# Altium schematic sheet Radio.SchDoc
size Letter; SheetNumber: 10
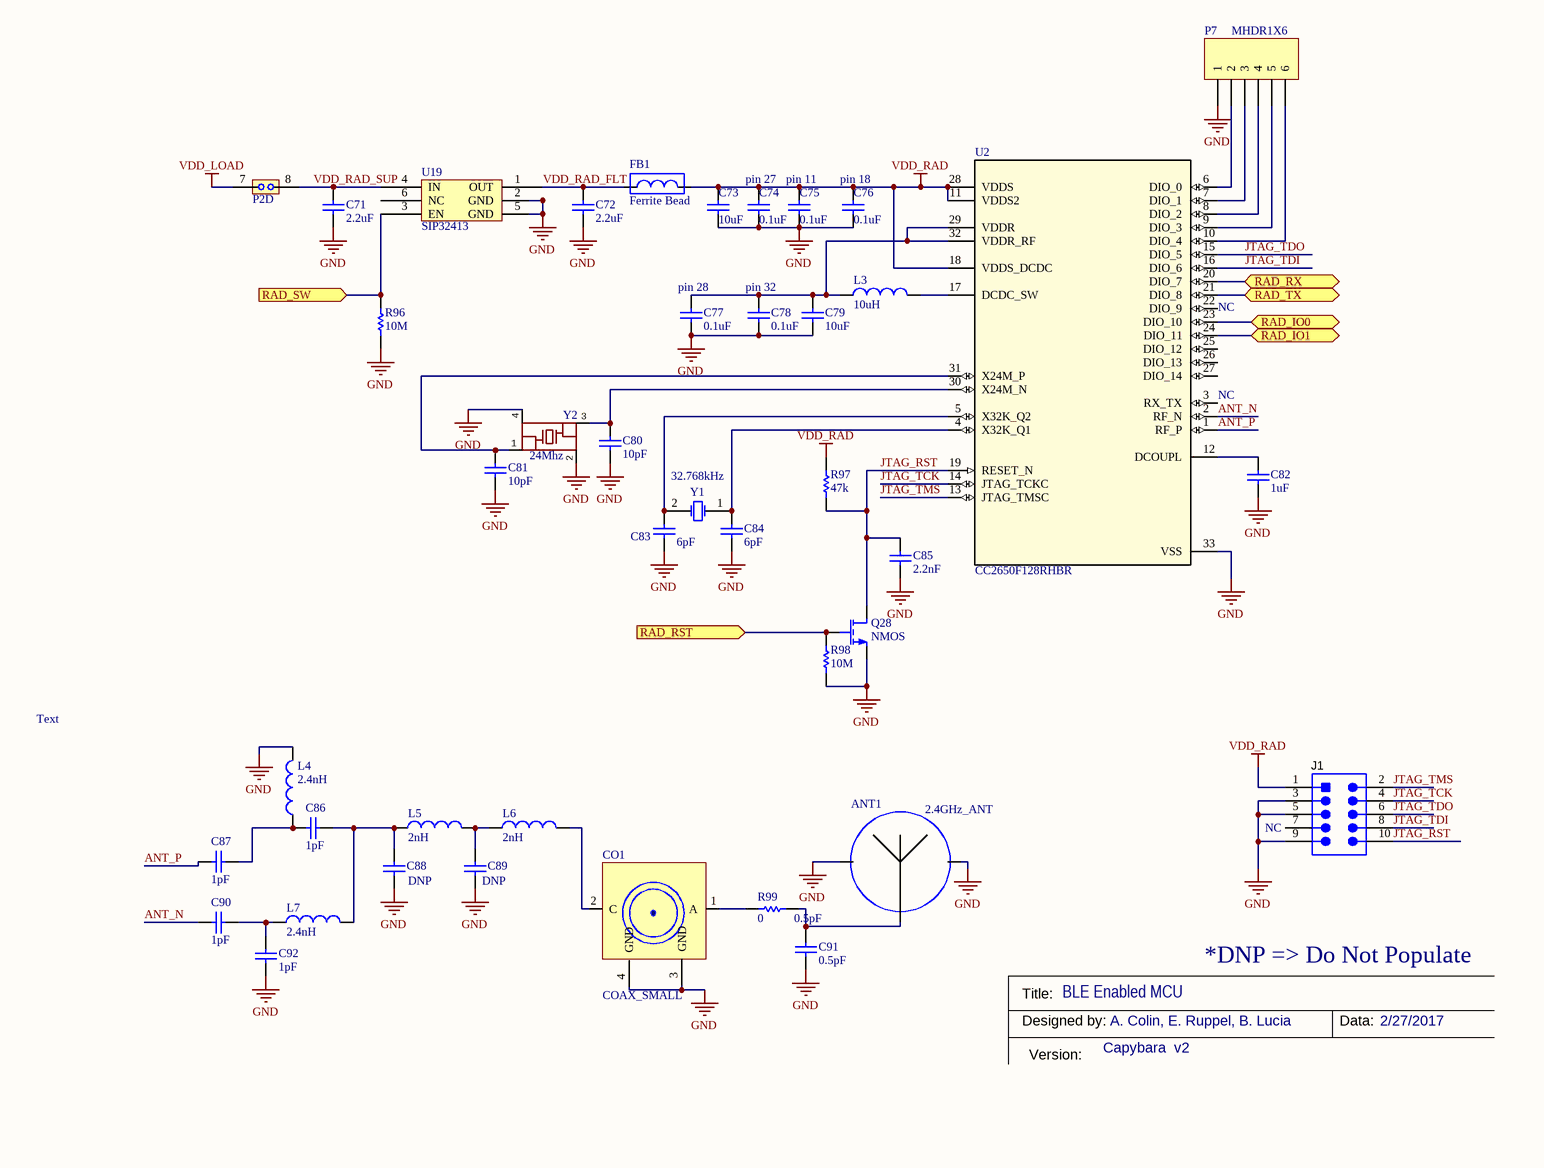
[diagram p0: Radio.SchDoc, bottom left]

## Parts
ANT1  2.4GHz_ANT  [IIF_INV]  (net tie, no BOM)
C71  value 2.2uF  [0603]  (hidden comment: Cap)
C72  value 2.2uF  [0603]  (hidden comment: Cap)
C73  value 10uF  [0603]  (hidden comment: Cap)
C74  value 0.1uF  [0603]  (hidden comment: Cap)
C75  value 0.1uF  [0603]  (hidden comment: Cap)
C76  value 0.1uF  [0603]  (hidden comment: Cap)
C77  value 0.1uF  [0603]  (hidden comment: Cap)
C78  value 0.1uF  [0603]  (hidden comment: Cap)
C79  value 10uF  [0603]  (hidden comment: Cap)
C80  value 10pF  [0402]  (hidden comment: Cap)
C81  value 10pF  [0402]  (hidden comment: Cap)
C82  value 1uF  [0603]  (hidden comment: Cap)
C83  value 6pF  [0402]  (hidden comment: Cap)
C84  value 6pF  [0402]  (hidden comment: Cap)
C85  value 2.2nF  [0603]  (hidden comment: Cap)
C86  value 1pF  [0402]  (hidden comment: Cap)
C87  value 1pF  [0402]  (hidden comment: Cap)
C88  Note: DNP  [0402]  (hidden comment: Cap)
C89  Note: DNP  [0402]  (hidden comment: Cap)
C90  value 1pF  [0402]  (hidden comment: Cap)
C91  value 0.5pF  Note: 0.5pF  [0402]  (hidden comment: Cap)
C92  value 1pF  [0402]  (hidden comment: Cap)
CO1  COAX_SMALL  [COAX SMALL_v2]
FB1  Ferrite Bead  [0603]
J1  (no value)  [JTAG_V3]
L3  value 10uH  [0603]  (hidden comment: Ind)
L4  value 2.4nH  [0402]  (hidden comment: Ind)
L5  value 2nH  [0402]  (hidden comment: Ind)
L6  value 2nH  [0402]  (hidden comment: Ind)
L7  value 2.4nH  [0402]  (hidden comment: Ind)
P2  JMPHDR_8  [MHDR2X8]  (value not drawn)  (part D of 8)
P7  MHDR1X6  [MHDR1X6]
Q28  NMOS  [SOT-523-3]
R96  value 10M  [0603]  (hidden comment: Res)
R97  value 47k  [0603]  (hidden comment: Res)
R98  value 10M  [0603]  (hidden comment: Res)
R99  value 0  [0402]  (hidden comment: Res)
U2  CC2650F128RHBR  [RHB0032E_NV]
U19  SIP32413  [SC70-6]
Y1  value 32.768kHz  [XTAL - 2Pin [3.2mm x 1.5mm]]
Y2  value 24Mhz  [XTAL - 4Pin [2.5mm x 2.0mm]]

## Ports
RAD_IO0 (bidir), RAD_IO1 (bidir), RAD_RST (in), RAD_RX (bidir), RAD_SW (in), RAD_TX (bidir)

## Nets
GND: ANT1.2(GND) ANT1.3(GND) C71.1 C72.1 C73.1 C74.1 C75.1 C76.1 C77.1 C78.1 C79.1 C80.1 C81.2 C82.1 C83.1 C84.1 C85.2 C88.1 C89.1 C91.1 C92.1 CO1.3(GND) CO1.4(GND) J1.3 J1.5 J1.9 L4.2 P7.1 Q28.2(S) R96.1 R98.1 U2.33(VSS) U19.2(GND) U19.5(GND) Y2.2(GROUND2) Y2.4(GROUND4)
VDD_LOAD: P2.7
VDD_RAD: C73.2 C74.2 C75.2 C76.2 FB1.2 J1.1 R97.2 U2.11(VDDS2) U2.18(VDDS_DCDC) U2.28(VDDS)
ANT_N: C90.2 U2.2(RF_N)
ANT_P: C87.2 U2.1(RF_P)
JTAG_RST: C85.1 J1.10 Q28.3(D) R97.1 U2.19(RESET_N)
JTAG_TCK: J1.4 U2.14(JTAG_TCKC)
JTAG_TDI: J1.8 U2.16(DIO_6)
JTAG_TDO: J1.6 U2.15(DIO_5)
JTAG_TMS: J1.2 U2.13(JTAG_TMSC)
RAD_IO0: U2.23(DIO_10) ; port RAD_IO0
RAD_IO1: U2.24(DIO_11) ; port RAD_IO1
RAD_RST: Q28.1(G) R98.2 ; port RAD_RST
RAD_RX: U2.20(DIO_7) ; port RAD_RX
RAD_SW: R96.2 U19.3(EN) ; port RAD_SW
RAD_TX: U2.21(DIO_8) ; port RAD_TX
VDD_RAD_FLT: C72.2 FB1.1 U19.1(OUT)
VDD_RAD_SUP: C71.2 P2.8 U19.4(IN)
NetANT1_1: ANT1.1(ANT) C91.2 R99.2
NetC77_2: C77.2 C78.2 C79.2 L3.1 U2.29(VDDR) U2.32(VDDR_RF)
NetC80_2: C80.2 U2.30(X24M_N) Y2.3(P3)
NetC81_1: C81.1 U2.31(X24M_P) Y2.1(P$1)
NetC82_2: C82.2 U2.12(DCOUPL)
NetC83_2: C83.2 U2.5(X32K_Q2) Y1.2(OSC2)
NetC84_2: C84.2 U2.4(X32K_Q1) Y1.1(OSC1)
NetC86_1: C86.1 C88.2 L5.1 L7.2
NetC86_2: C86.2 C87.1 L4.1
NetC89_2: C89.2 L5.2 L6.1
NetC90_1: C90.1 C92.2 L7.1
NetCO1_1: CO1.1(A) R99.1
NetCO1_2: CO1.2(C) L6.2
NetL3_2: L3.2 U2.17(DCDC_SW)
NetP7_2: P7.2 U2.6(DIO_0)
NetP7_3: P7.3 U2.7(DIO_1)
NetP7_4: P7.4 U2.8(DIO_2)
NetP7_5: P7.5 U2.9(DIO_3)
NetP7_6: P7.6 U2.10(DIO_4)

Not connected (* = marked no-connect by the designer): J1 7; U2 3(RX_TX) 22(DIO_9) 25(DIO_12) 26(DIO_13) 27(DIO_14); U19 6(NC)

## Notes on the sheet
- pin 27
- (near C75) pin 11
- (near C76) pin 18
- (near C77) pin 28
- (near C78) pin 32
- (near U2) NC
- Text
- (near J1) NC
- *DNP => Do Not Populate
- Title:
- Designed by:
- BLE Enabled MCU
- A. Colin, E. Ruppel, B. Lucia
- Data:
- 2/27/2017
- Version:
- Capybara  v2

## Library data of the parts
C71 C72 = Cap: Ceramic Capacitor (Surface Mount); Manufacturer: Murata Electronics North America; Manufacturer Part Number: GRM188R61C225KE15D; Digi-Key Part Number: *; Note: *; Rating: *; Distributor Part Number: 490-3296-1-ND; Distributor: Digi-Key
C73 C79 = Cap: Ceramic Capacitor (Surface Mount); Manufacturer: Murata Electronics North America; Manufacturer Part Number: GRM188R60J106ME47D; Digi-Key Part Number: *; Note: *; Rating: *; Distributor Part Number: 490-3896-1-ND; Distributor: Digi-Key
C74-C78 = Cap: Ceramic Capacitor (Surface Mount); Manufacturer: Murata Electronics North America; Manufacturer Part Number: GRM188R71C104KA01D; Digi-Key Part Number: *; Note: *; Rating: *; Distributor Part Number: 490-1532-1-ND; Distributor: Digi-Key
C80 C81 = Cap: Ceramic Capacitor (Surface Mount); Manufacturer: AvX; Manufacturer Part Number: 04025A100MAT2A; Digi-Key Part Number: *; Note: *; Rating: *; Distributor Part Number: 581-04025A100MAT2A; Distributor: Mouser
C82 = Cap: Ceramic Capacitor (Surface Mount); Manufacturer: Murata Electronics North America; Manufacturer Part Number: GRM188R61A105KA61D; Digi-Key Part Number: *; Note: *; Rating: *; Distributor Part Number: 490-1543-1-ND; Distributor: Digi-Key
C83 C84 = Cap: Ceramic Capacitor (Surface Mount); Manufacturer: Murata Electronics North America; Manufacturer Part Number: GRM1555C1H6R0CA01D; Digi-Key Part Number: *; Rating: *; Distributor Part Number: 490-8222-1-ND; Distributor: Digi-Key
C85 = Cap: Ceramic Capacitor (Surface Mount); Manufacturer: Murata Electronics North America; Manufacturer Part Number: GRM1885C1H222JA01D; Rating: *; Distributor Part Number: 490-1459-1-ND; Distributor: Digi-Key
C86 C87 C90 C92 = Cap: Ceramic Capacitor (Surface Mount); Manufacturer: Murata Electronics; Manufacturer Part Number: GJM1555C1H1R0BB01D; Note: DNP; Digi-Key Part Number: 712-1266-1-ND; Rating: *; Distributor Part Number: 490-6073-1-ND; Distributor: Digi-Key
C88 C89 = Cap: Ceramic Capacitor (Surface Mount); Manufacturer: Generic Ceramic Chip Cap (TBD); Digi-Key Part Number: *; Manufacturer Part Number: *; Rating: *; Distributor Part Number: *; Distributor: *
C91 = Cap: Ceramic Capacitor (Surface Mount); Manufacturer: Murata Electronics; Digi-Key Part Number: *; Manufacturer Part Number: *; Rating: *; Distributor Part Number: 490-6263-1-nd; Distributor: Digikey
CO1 = COAX_SMALL: ms-156hf; Manufacturer: Hirose Connector; Manufacturer Part Number: MS-156HF(20); Distributor: Mouser; Distributor Part Number: 798-MS156HF20; Mouser Part Number: 798-MS156HF20
FB1 = Ferrite Bead: Ferrite bead, RF choke; Manufacturer: Murata Electronics North America; Manufacturer Part Number: BLM18HE152SN1D; Digi-Key Part Number: 490-5216-1-ND; Rating: *; Note: *; Value: *; Distributor: Digikey; Distributor Part Number: 490-5216-1-ND
J1 = GRPB052VWVN-RC: Header, 50mil, 5x2, Gold, TH; Manufacturer: Samtec Inc.; Manufacturer Part Number: FTSH-105-01-L-D-K; U/M: EA; PackageReference: Header, 5x2, 50mil; CompType: Header; RoHS: Y; MountType: TH; ComponentLink1Description: Datasheet Link; Publisher: Texas Instruments; LatestRevisionDate: 2015-08-06; Supplier 1: Digi-Key; ClassName: Header; Distributor: Digikey; Distributor Part Number: SAM8798-ND
L3 = Ind: Inductor (Surface Mount); Manufacturer: Taiyo Yuden; Manufacturer Part Number: LB1608T100M; Alternate Manufacturer: Digikey; Alternate PartNumber: 587-2243-1-ND; Digi-Key Part Number: 587-2243-1-nd; Rating: *; Note: *; Distributor: Mouser; Distributor Part Number: 963-LB1608T100M; Mouser Part Number: 963-LB1608T100M
L4 = Ind: Inductor (Surface Mount); Manufacturer: Murata Electronics North America; Manufacturer Part Number: LQG15HS2N4S02D; Digi-Key Part Number: 490-8389-1-ND; Rating: *; Note: *; Distributor: Digikey; Distributor Part Number: 490-8389-1-ND; Mouser Part Number: LQG15HS2N4S02D
L5 L6 = Ind: Inductor (Surface Mount); Manufacturer: Murata Electronics North America; Manufacturer Part Number: LQG15HS2N0S02D; Digi-Key Part Number: *; Rating: *; Note: *; Distributor: Digikey; Distributor Part Number: 490-6569-1-ND
L7 = Ind: Inductor (Surface Mount); Manufacturer: Murata Electronics North America; Digi-Key Part Number: 490-8389-1-ND; Manufacturer Part Number: Murata Electronics North America; Rating: *; Note: *; Distributor: Digikey; Distributor Part Number: 490-8389-1-ND; Mouser Part Number: LQG15HS2N4S02D
P7 = MHDR1X6: Header, 6-Pin; Manufacturer: Harwin Inc.; Manufacturer Part Number: M52-5000645; LatestRevisionDate: 17-Jul-2002; LatestRevisionNote: Re-released for DXP Platform.; Publisher: Altium Limited; Digi-Key Part Number: 952-3359-ND; Distributor: Digikey; Distributor Part Number: 855-M52-5000645; Mouser Part Number: 855-M52-5000645
Q28 = MOSFET-N: N-Channel MOSFET; Manufacturer Part Number: FDY302NZ; Manufacturer: Fairchild; Note: *; Rating: *; Value: NMOS; Distributor: Digi-Key; Distributor Part Number: FDY302NZCT-ND
R96 R98 = Res: Chip Resistor (Surface Mount); Manufacturer: Yageo; Manufacturer Part Number: RC0603JR-0710ML; Rating: *; Note: *; Distributor: Digi-Key; Distributor Part Number: 311-10MGRCT-ND
  R96: Digi-Key Part Number: *
R97 = Res: Chip Resistor (Surface Mount); Manufacturer: Yageo; Manufacturer Part Number: RT0603DRD0747KL; Rating: *; Note: *; Distributor: Digi-Key; Distributor Part Number: 311-47KDCT-ND
R99 = Res: Chip Resistor (Surface Mount); Manufacturer: Panasonic Electronic Components; Manufacturer Part Number: ERJ-2GE0R00X; Digi-Key Part Number: *; Rating: *; Note: *; Distributor: Digi-Key; Distributor Part Number: P0.0JCT-ND
U2 = CC2650F128RHBR: Imported; Alternate_PartNumber: CC2650F128RHBT; Manufacturer: Texas Instruments; CompType: IC; PIN_COUNT: 33; Application_BuildNumber: *; PartNumber: CC2650F128RHBR; PackageReference: RHB0032E; MountType: SMT; RoHS: Y; RefDes: RefDes; TYPE: TYPE; Digi-Key Part Number: 296-41955-1-ND; Distributor: Mouser; Distributor Part Number: 595-CC2650F128RHBT; Manufacturer Part Number: CC2650F128RHBT; Mouser Part Number: 595-CC2650F128RHBT
U19 = SIP32431: Manufacturer: Vishay Semiconductors; Manufacturer Part Number: SIP32431DR3-T1GE3; Digi-Key Part Number: SIP32431DR3-T1GE3CT-ND; Distributor: Mouser; Distributor Part Number: 781-SIP32431DR3-GE3; Mouser Part Number: 781-SIP32431DR3-GE3
Y1 = XTAL: Crystal Oscillator; Manufacturer: ECS Inc.; Manufacturer Part Number: ECS-.327-6-34QCS-TR; Rating: 6pF; Distributor: Mouser; Distributor Part Number: 520-.327-6-34QCST; Digi-Key Part Number: XC2162CT-ND; Mouser Part Number: 520-.327-6-34QCST
Y2 = ABM11_CERAMIC_SMD_CRYSTALABM11: Manufacturer: ECS Inc.; Manufacturer Part Number: ECS-240-8-36CKM-TR; Rating: 8pF; Distributor: Mouser; Distributor Part Number: 520-ECS-240-8-36CKM; Mouser Part Number: 520-ECS-240-8-36CKM; Digi-Key Part Number: XC1557CT-ND